# EasyEDA schematic OKUMU-JIMMY-WORK-MODULE_2025-07-22.json
TITLE: Sheet_1; REV: 1.0; Date: 2025-07-15; Sheet: 1/1; Company: Your Company
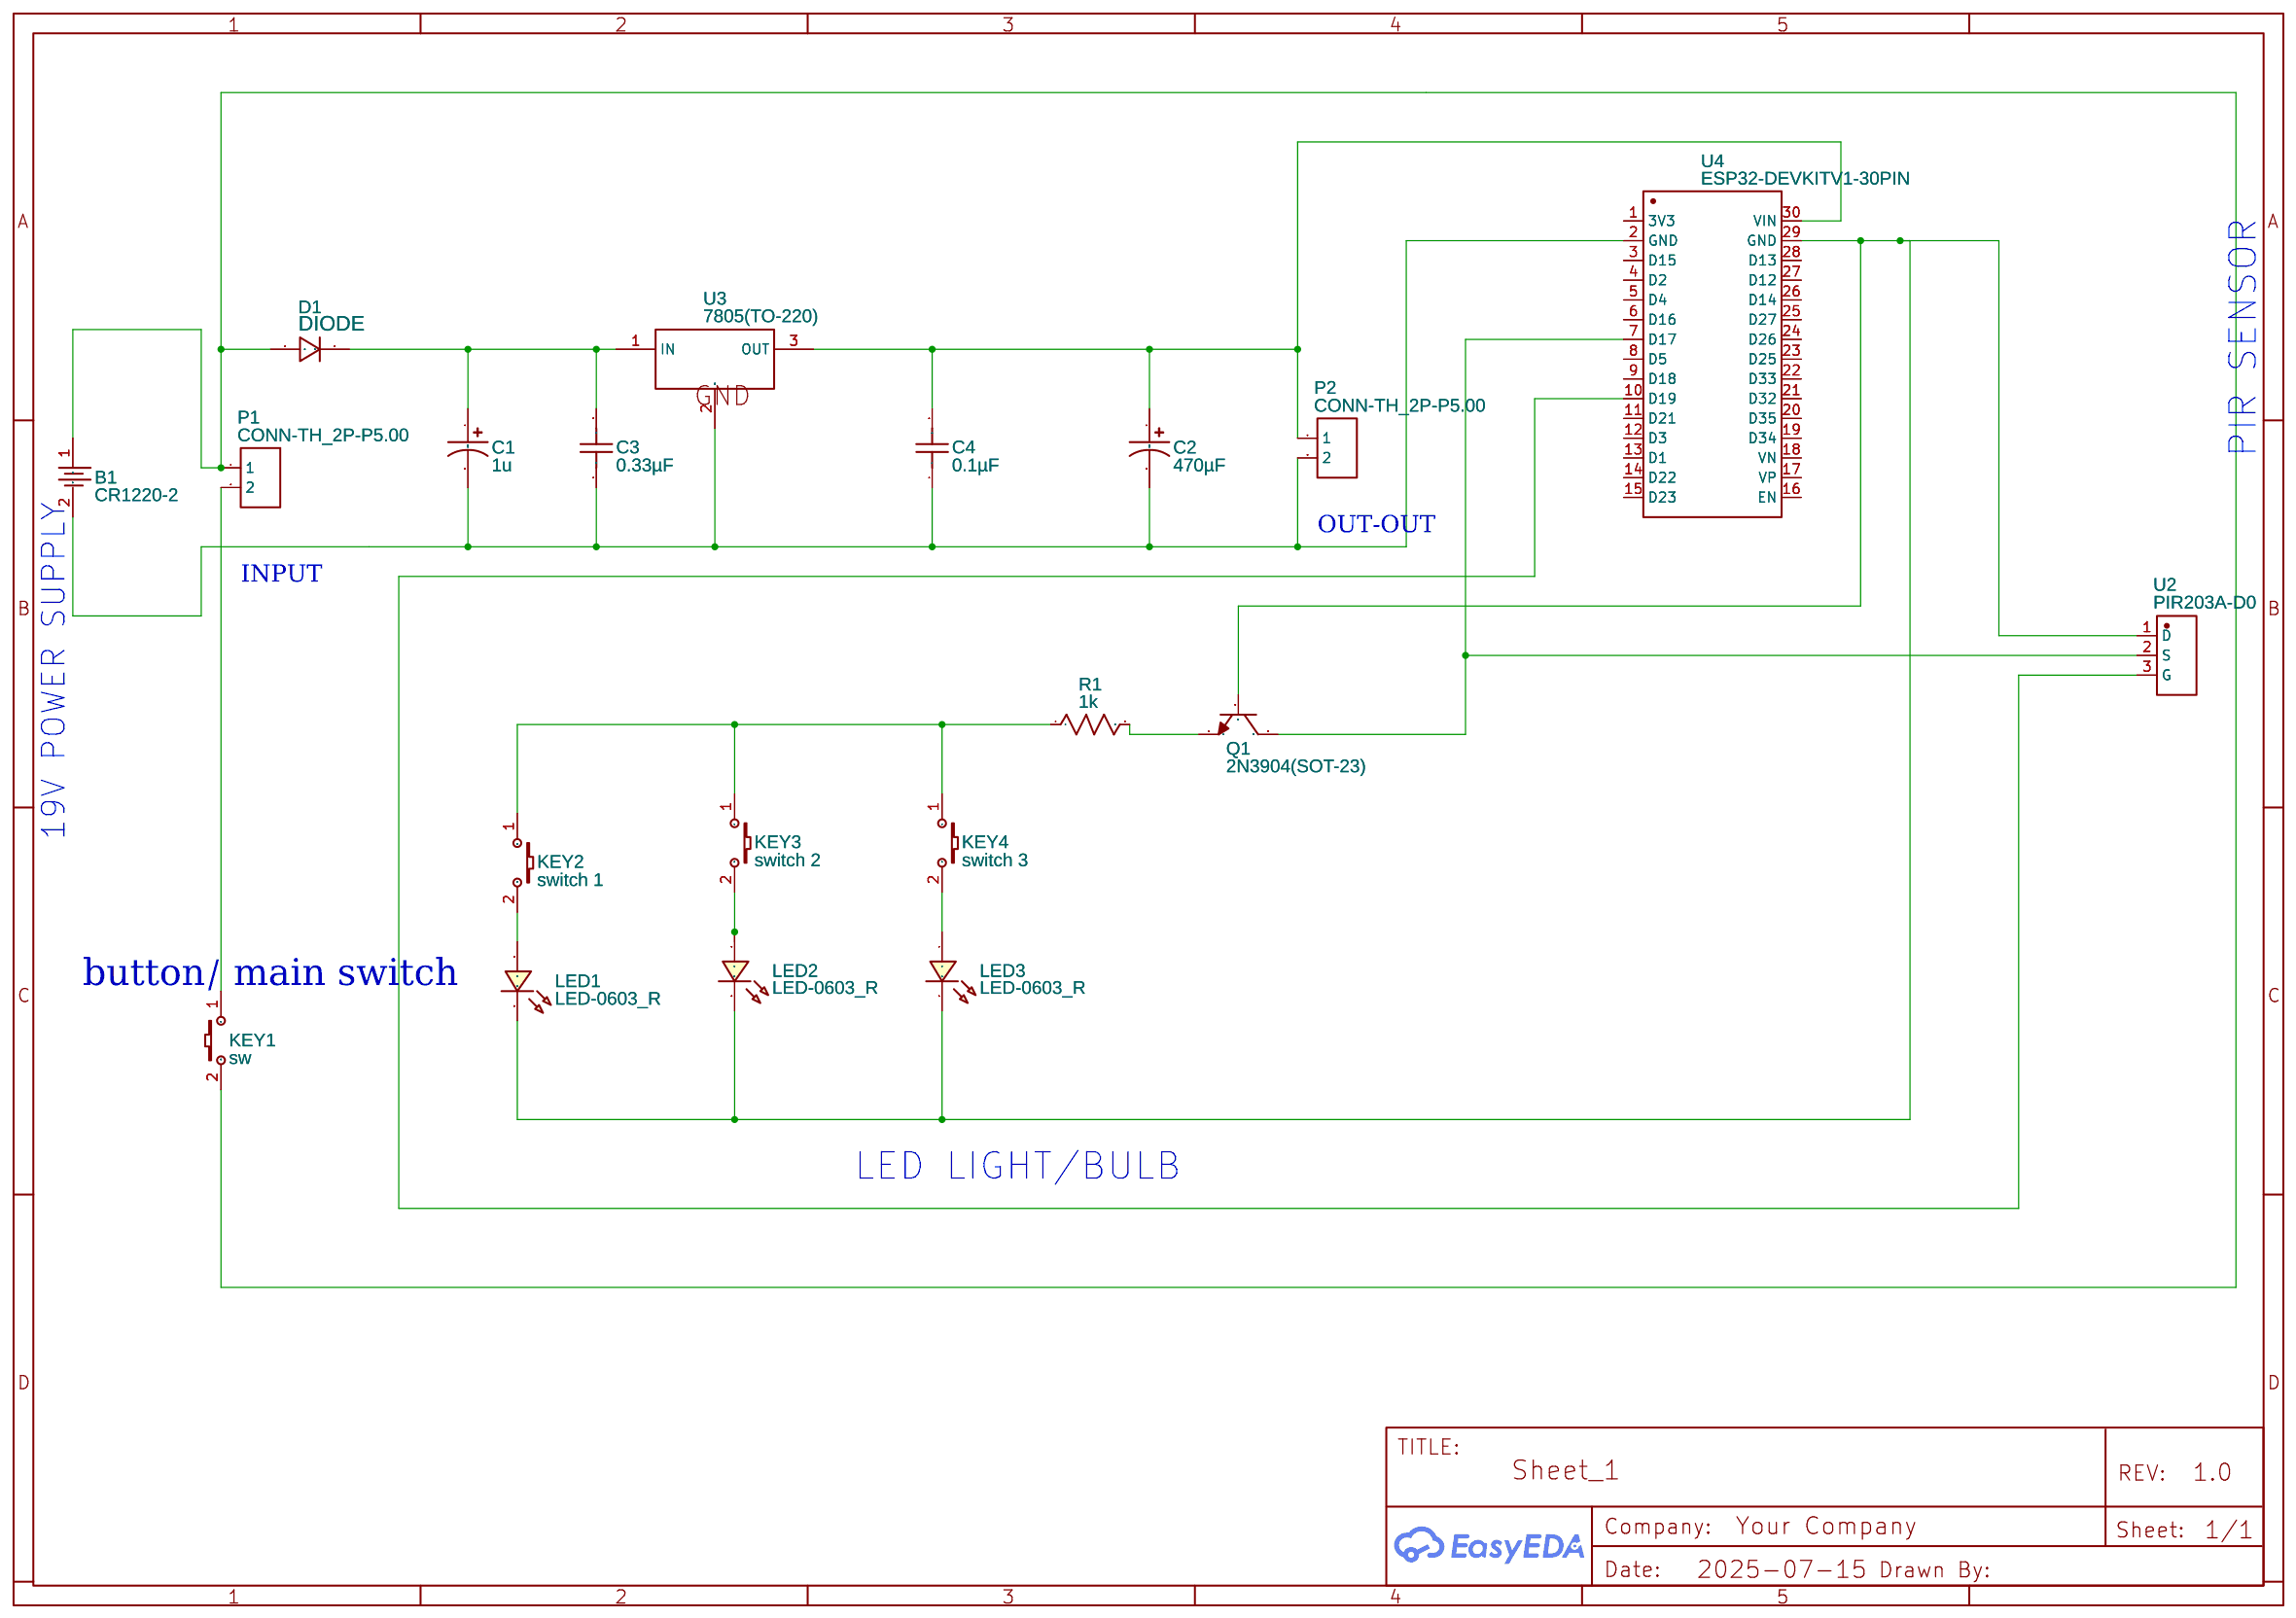
[diagram p0: schematic sheet]

## Parts
B1  CR1220-2  [BAT-SMD_CR1220-2]
C1  1u  [CAP-D3.0×F1.5]
C2  470µF  [CAP-D3.0×F1.5]
C3  0.33µF  [RAD-0.1]
C4  0.1µF  [RAD-0.1]
D1  DIODE  [SOD-123_L2.8-W1.8-LS3.7-RD]
KEY1  sw  [KEY-SMD_2P-L6.2-W3.6-LS8.0]
KEY2  switch 1  [KEY-SMD_2P-L6.2-W3.6-LS8.0]
KEY3  switch 2  [KEY-SMD_2P-L6.2-W3.6-LS8.0]
KEY4  switch 3  [KEY-SMD_2P-L6.2-W3.6-LS8.0]
LED1  LED-0603_R  [LED0603_RED]
LED2  LED-0603_R  [LED0603_RED]
LED3  LED-0603_R  [LED0603_RED]
P1  CONN-TH_2P-P5.00  [CONN-TH_2P-P5.00]
P2  CONN-TH_2P-P5.00  [CONN-TH_2P-P5.00]
Q1  2N3904(SOT-23)  [SOT-23-3_L2.9-W1.3-P1.90-LS2.4-TR]
R1  1k  [R0603]
U2  PIR203A-D0  [TO-5-3_BD9.1-P2.54_PIR203A-D0]
U3  7805(TO-220)  [TO-220-3_L10.0-W4.5-P2.54-L]
U4  ESP32-DEVKITV1-30PIN  [ESP32-DEVKITV1-30PIN]

## Library data of the parts
B1 = CR1220-2: Supplier: LCSC; Manufacturer: Q&J; image: //image.lceda.cn/szlcsc/C70381.jpg; Supplier Part: C70381
C1 C2 = CE_TH_D3.0×F1.5_US: Contributor: LCEDA_Lib
C3 C4 = C_RAD-0.1_US: Contributor: LCEDA_Lib
D1 = 1N4007W: Supplier: LCSC; Supplier Part: C328592; Manufacturer: BLUE ROCKET; Contributor: LCEDA_Lib
KEY1-KEY4 = K2-3.6×6.1_SMD: Supplier Part: C118141; Supplier: LCSC; Manufacturer Part: K2-1107ST-A4SW-06; Contributor: LCEDA_Lib; 制造商: 韩国韩荣
LED1-LED3 = LED-0603_R: Manufacturer: EVERLIGHT(台湾亿光); Manufacturer Part: 19-217/R6C-AL1M2VY/3T; Supplier Part: C72044; Supplier: LCSC; Contributor: LCEDA_01
P1 P2 = CONN-TH_2P-P5.00: Supplier: LCSC; Contributor: LCEDA_Lib
Q1 = 2N3904(SOT-23): Supplier: LCSC; Manufacturer: KEC; Manufacturer Part: 2n3904S-RTK/PS; Supplier Part: C18536; Paste Type: SOT-23; Contributor: LCEDA_Lib
R1 = R_0603_US: Contributor: LCEDA_Lib
U2 = PIR203A-D0: Supplier: LCSC; Supplier Part: C2887900; Manufacturer: NEWOPTO(鑫永诚光电); Contributor: lcsc
U3 = 7805(TO-220): Supplier: LCSC; Manufacturer: STMicroelectronics; Manufacturer Part: L7805CV-DG; Supplier Part: C3795; Contributor: LCEDA_Lib
U4 = ESP32-DEVKITV1-30PIN: Supplier Part: ESP32; Manufacturer: ESPRESSIF(乐鑫); Manufacturer Part: ESP32-DevKitV; Contributor: alcachofeiro; JLCPCB Part Class: Extended Part

## Nets
Net-(B1-1): B1.1 D1.2 KEY1.2 P1.1
Net-(B1-2): B1.2 C1.2 C2.2 C3.1 C4.1 P2.2 U3.2(GND) U4.2(GND)
Net-(C1-1): C1.1 C3.2 D1.1 U3.1(IN)
Net-(C2-1): C2.1 C4.2 P2.1 U3.3(OUT) U4.30(VIN)
Net-(KEY1-1): KEY1.1 P1.2
Net-(KEY2-1): KEY2.1 KEY3.1 KEY4.1 R1.1
Net-(KEY2-2): KEY2.2 LED1.1
Net-(KEY3-2): KEY3.2 LED2.1
Net-(KEY4-2): KEY4.2 LED3.1
Net-(LED1-2): LED1.2 LED2.2 LED3.2 Q1.2(B) U2.1(D) U4.29(GND)
Net-(Q1-1): Q1.1(E) R1.2
Net-(Q1-3): Q1.3(C) U2.2(S) U4.7(D17)
Net-(U2-3): U2.3(G) U4.10(D19)

Not connected (* = marked no-connect by the designer): U4 1(3V3) 3(D15) 4(D2) 5(D4) 6(D16) 8(D5) 9(D18) 11(D21) 12(D3) 13(D1) 14(D22) 15(D23) 16(EN) 17(VP) 18(VN) 19(D34) 20(D35) 21(D32) 22(D33) 23(D25) 24(D26) 25(D27) 26(D14) 27(D12) 28(D13)

## Notes on the sheet
- PIR SENSOR
- OUT-OUT
- INPUT
- 19V POWER SUPPLY
- button/ main switch
- LED LIGHT/BULB
